# Altium schematic sheet Sheet1.SchDoc
size A
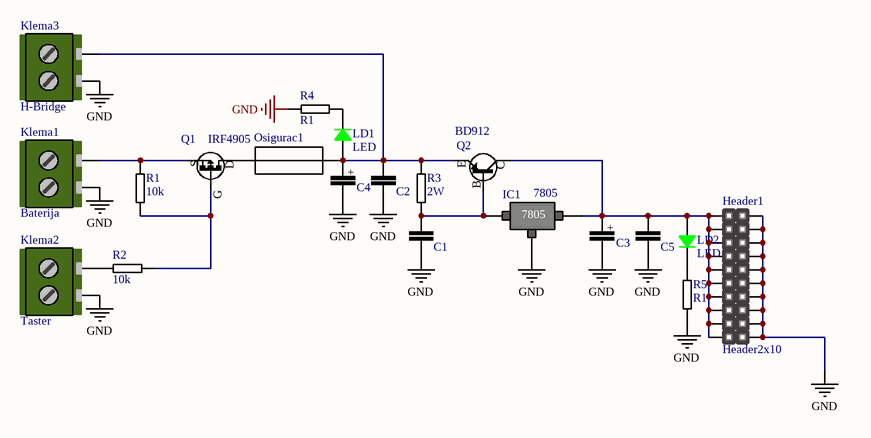
[diagram p0: Sheet1.SchDoc]

## Parts
C1  C1  [C1(ceramic)]  (value not drawn)
C2  C1  [C1(ceramic)]  (value not drawn)
C3  C2  [C2(elektrolit)]  (value not drawn)
C4  C2  [C2(elektrolit)]  (value not drawn)
C5  C1  [C1(ceramic)]  (value not drawn)
Header1  Header2x10  [HEADER2x10]
IC1  7805  [TO220_Savijeni]
Klema1  Baterija  [Klema]
Klema2  Taster  [Klema]
Klema3  H-Bridge  [Klema]
LD1  LED  [LED(3mm)]
LD2  LED  [LED(3mm)]
Osigurac1  FUSE  [Osigurac]  (value not drawn)
Q1  IRF4905  [TO220_Savijeni]
Q2  BD912  [TO220_Savijeni]
R1  10k  [R1(300milsa)]
R2  10k  [R1(300milsa)]
R3  2W  [R1(2W)]
R4  R1  [R1(300milsa)]
R5  R1  [R1(300milsa)]

## Nets
GND: C1.1 C2.2 C3.2 C4.2 C5.2 Header1.2 Header1.4 Header1.6 Header1.8 Header1.10 Header1.12 Header1.14 Header1.16 Header1.18 Header1.20 IC1.2 Klema1.1 Klema2.1 Klema3.1 R4.1 R5.1
NetC1_2: C1.2 IC1.1 Q2.1 R3.2
NetC2_1: C2.1 C4.1 Klema3.2 LD1.1 Osigurac1.2 Q2.2 R3.1
NetC3_1: C3.1 C5.1 Header1.1 Header1.3 Header1.5 Header1.7 Header1.9 Header1.11 Header1.13 Header1.15 Header1.17 Header1.19 IC1.3 LD2.1 Q2.3
NetKlema1_2: Klema1.2 Q1.3 R1.2
NetKlema2_2: Klema2.2 R2.2
NetLD1_2: LD1.2 R4.2
NetLD2_2: LD2.2 R5.2
NetOsigurac1_1: Osigurac1.1 Q1.2
NetQ1_1: Q1.1 R1.1 R2.1

## Notes on the sheet
- (in symbol C2) +
- (in symbol P-Channel MOSFET) S; D; G
- (in symbol Transistor PNP) E; C; B

## Library data of the parts
Klema1-Klema3 = Klema
Q1 = P-Channel MOSFET
Q2 = Transistor PNP
R1-R3 = R1